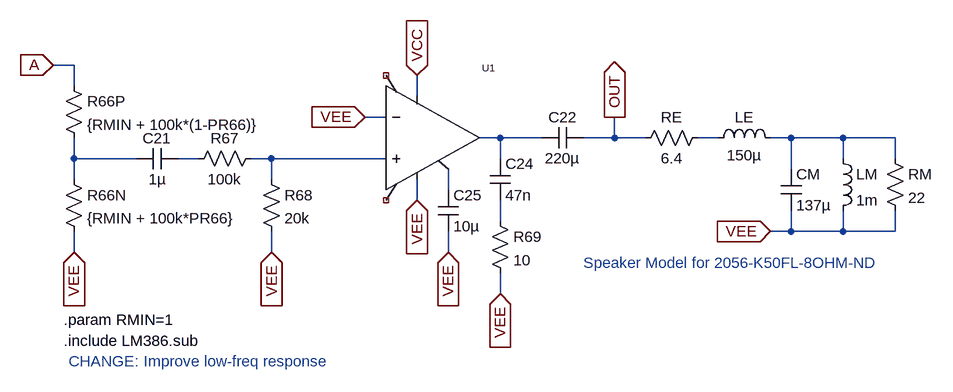
[diagram p0: schematic Amplifier.asc]
Amplifier.asc, the LTspice schematic file:
Version 4.1
SHEET 1 2252 1156
WIRE 112 368 80 368
WIRE 112 400 112 368
WIRE 640 416 640 384
WIRE 592 448 560 448
WIRE 768 480 736 480
WIRE 832 480 768 480
WIRE 944 480 944 448
WIRE 944 480 896 480
WIRE 992 480 944 480
WIRE 1104 480 1072 480
WIRE 1216 480 1184 480
WIRE 1296 480 1216 480
WIRE 1376 480 1296 480
WIRE 112 512 112 480
WIRE 208 512 112 512
WIRE 304 512 272 512
WIRE 416 512 384 512
WIRE 592 512 416 512
WIRE 768 512 768 480
WIRE 1296 512 1296 480
WIRE 1376 512 1376 480
WIRE 1216 528 1216 480
WIRE 112 544 112 512
WIRE 416 544 416 512
WIRE 688 560 688 528
WIRE 640 576 640 544
WIRE 768 608 768 576
WIRE 1216 624 1216 592
WIRE 1216 624 1184 624
WIRE 1296 624 1296 592
WIRE 1296 624 1216 624
WIRE 1376 624 1376 592
WIRE 1376 624 1296 624
WIRE 112 656 112 624
WIRE 416 656 416 624
WIRE 688 656 688 624
WIRE 768 720 768 688
FLAG 640 384 VCC
IOPIN 640 384 In
FLAG 640 576 VEE
IOPIN 640 576 In
FLAG 112 656 VEE
IOPIN 112 656 In
FLAG 80 368 A
IOPIN 80 368 In
FLAG 416 656 VEE
IOPIN 416 656 In
FLAG 688 656 VEE
IOPIN 688 656 In
FLAG 560 448 VEE
IOPIN 560 448 In
FLAG 768 720 VEE
IOPIN 768 720 In
FLAG 1184 624 VEE
IOPIN 1184 624 In
FLAG 944 448 OUT
IOPIN 944 448 Out
SYMBOL res 96 384 R0
SYMATTR InstName R66P
SYMATTR Value {RMIN + 100k*(1-PR66)}
SYMBOL res 96 528 R0
SYMATTR InstName R66N
SYMATTR Value {RMIN + 100k*PR66}
SYMBOL cap 272 496 R90
WINDOW 0 0 32 VBottom 2
WINDOW 3 32 32 VTop 2
SYMATTR InstName C21
SYMATTR Value 1µ
SYMBOL res 400 496 R90
WINDOW 0 0 56 VBottom 2
WINDOW 3 32 56 VTop 2
SYMATTR InstName R67
SYMATTR Value 100k
SYMBOL res 400 528 R0
SYMATTR InstName R68
SYMATTR Value 20k
SYMBOL LM386 640 480 R0
SYMATTR InstName U1
SYMBOL cap 672 560 R0
SYMATTR InstName C25
SYMATTR Value 10µ
SYMBOL cap 752 512 R0
SYMATTR InstName C24
SYMATTR Value 47n
SYMBOL res 752 592 R0
SYMATTR InstName R69
SYMATTR Value 10
SYMBOL cap 896 464 R90
WINDOW 0 0 32 VBottom 2
WINDOW 3 32 32 VTop 2
SYMATTR InstName C22
SYMATTR Value 220µ
SYMBOL res 1088 464 R90
WINDOW 0 0 56 VBottom 2
WINDOW 3 32 56 VTop 2
SYMATTR InstName RE
SYMATTR Value 6.4
SYMBOL ind 1088 496 R270
WINDOW 0 32 56 VTop 2
WINDOW 3 5 56 VBottom 2
SYMATTR InstName LE
SYMATTR Value 150µ
SYMATTR SpiceLine Rser=1m
SYMBOL cap 1200 528 R0
SYMATTR InstName CM
SYMATTR Value 137µ
SYMBOL ind 1280 496 R0
SYMATTR InstName LM
SYMATTR Value 1m
SYMATTR SpiceLine Rser=1m
SYMBOL res 1360 496 R0
SYMATTR InstName RM
SYMATTR Value 22
TEXT 104 824 Left 2 ;CHANGE: Improve low-freq response
TEXT 96 792 Left 2 !.include LM386.sub
TEXT 896 672 Left 2 ;Speaker Model for 2056-K50FL-8OHM-ND
TEXT 96 760 Left 2 !.param RMIN=1

The netlist it stands for:
* Amplifier.asc
R66P A N004 {RMIN + 100k*(1-PR66)}
R66N N004 VEE {RMIN + 100k*PR66}
C21 N005 N004 1µ
R67 N006 N005 100k
R68 N006 VEE 20k
X§U1 NC_01 VEE N006 VEE N001 VCC N007 NC_02 LM386  ; pins G1 INN INP VSS OUT VDD BYP G8
C25 N007 VEE 10µ
C24 N001 N008 47n
R69 N008 VEE 10
C22 OUT N001 220µ
RE N002 OUT 6.4
LE N002 N003 150µ Rser=1m
CM N003 VEE 137µ
LM N003 VEE 1m Rser=1m
RM N003 VEE 22
* CHANGE: Improve low-freq response
.include LM386.sub
* Speaker Model for 2056-K50FL-8OHM-ND
.param RMIN=1
.backanno
.end